# Altium project LP_LED_CUBE_8x8x8.PrjPcb
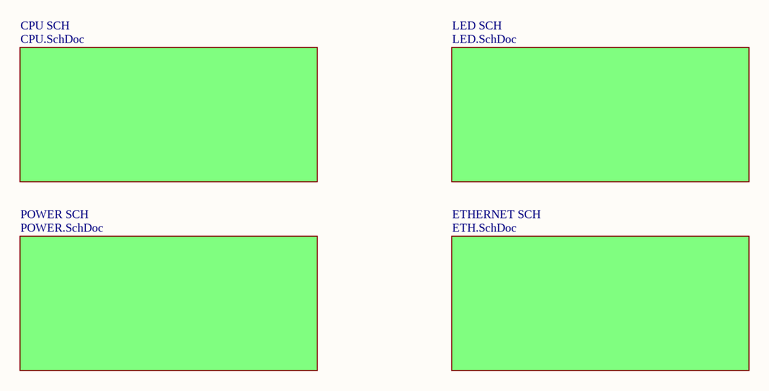
[diagram p0: LP_LED_CUBE_8x8x8.SchDoc]
Title: LED Cube 8x8x8
5 sheets, 91 parts. Net scope: global (net labels, ports and power ports of the same name join across sheets).
Board file: LP_LED_CUBE_8x8x8.PcbDoc
Sheets:
  LP_LED_CUBE_8x8x8.SchDoc
    CPU SCH = CPU.SchDoc
    LED SCH = LED.SchDoc
    POWER SCH = POWER.SchDoc
    ETHERNET SCH = ETH.SchDoc

## Sheet LP_LED_CUBE_8x8x8.SchDoc: LED Cube 8x8x8
size A4

### Sub-sheets
CPU SCH = CPU.SchDoc: no entries
ETHERNET SCH = ETH.SchDoc: no entries
LED SCH = LED.SchDoc: no entries
POWER SCH = POWER.SchDoc: no entries

## Sheet CPU.SchDoc: LED CUBE 8x8x8 - CPU
size A4; Author: Luka Penger; CompanyName: L. Penger; DrawnBy: Luka Penger; Organization: L. Penger; Address1: Luka Penger; Address2: http://lukapenger.eu; Address3: Software & Hardware; Address4: Development; DocumentNumber: 1; Revision: 4.0.0; SheetNumber: 1; SheetTotal: 5; DocumentName: CPU; ImagePath: I:\lp-led-cube-8x8x8\LP_LED_CUBE_8x8x8_PCB\ver_1.0.0; ProjectName: LED CUBE 8x8x8
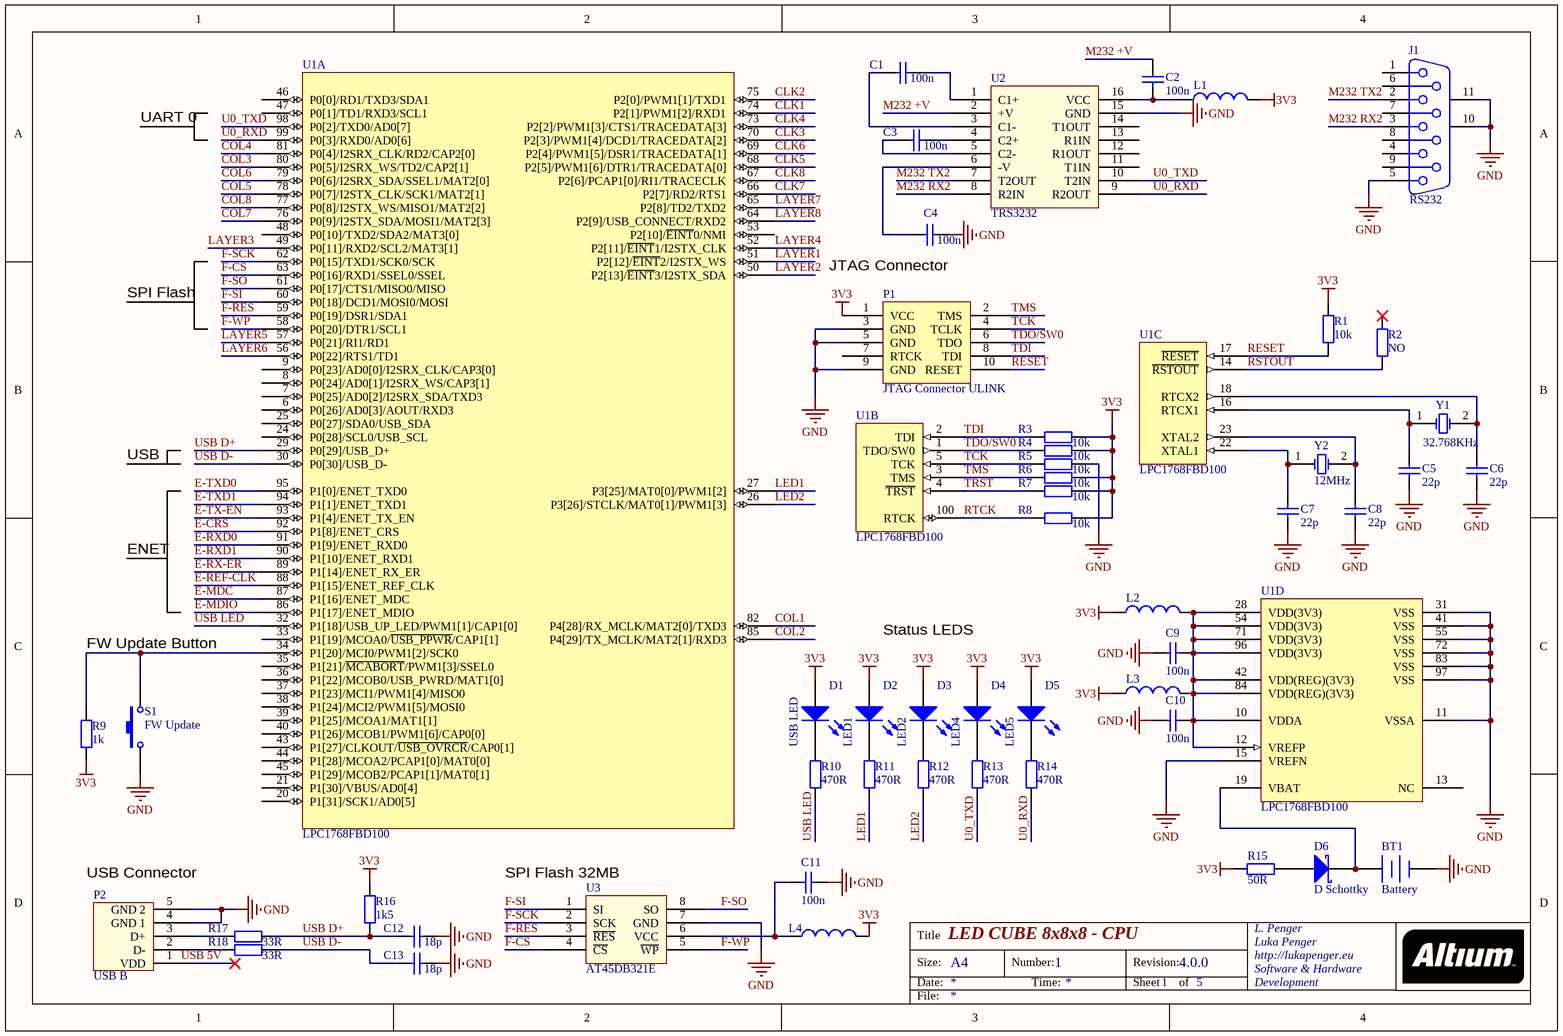
[diagram p1: CPU.SchDoc]

### Parts
BT1  Battery  [Battery capacitor]
C1  100n  [1608[0603]]
C2  100n  [1608[0603]]
C3  100n  [1608[0603]]
C4  100n  [1608[0603]]
C5  22p  [1608[0603]]
C6  22p  [1608[0603]]
C7  22p  [1608[0603]]
C8  22p  [1608[0603]]
C9  100n  [1608[0603]]
C10  100n  [1608[0603]]
C11  100n  [1608[0603]]
C12  18p  [1608[0603]]
C13  18p  [1608[0603]]
D1  USB LED  [LED-1]
D2  LED1  [LED-1]
D3  LED2  [LED-1]
D4  LED4  [LED-1]
D5  LED5  [LED-1]
D6  D Schottky  [SMB]
J1  RS232  [DSUB1.385-2H9]
L1  Inductor  [1608[0603]]  (value not drawn)
L2  Inductor  [1608[0603]]  (value not drawn)
L3  Inductor  [1608[0603]]  (value not drawn)
L4  Inductor  [1608[0603]]  (value not drawn)
P1  JTAG Connector ULINK  [JTAG Connector ULINK]
P2  USB B  [USB B]
R1  10k  [1608[0603]]
R2  NO  [1608[0603]]
R3  10k  [1608[0603]]
R4  10k  [1608[0603]]
R5  10k  [1608[0603]]
R6  10k  [1608[0603]]
R7  10k  [1608[0603]]
R8  10k  [1608[0603]]
R9  1k  [1608[0603]]
R10  470R  [1608[0603]]
R11  470R  [1608[0603]]
R12  470R  [1608[0603]]
R13  470R  [1608[0603]]
R14  470R  [1608[0603]]
R15  50R  [6-0805_N]
R16  1k5  [1608[0603]]
R17  33R  [1608[0603]]
R18  33R  [1608[0603]]
S1  FW Update  [SWITCH-TACTILE-90]
U1  LPC1768FBD100  [SOT407-1_N]  (parts A,B,C,D of 4)
U2  TRS3232  [SOIC16_N]
U3  AT45DB321E  [AT45DB321D]
Y1  32.768KHz  [Crystal 4.1x1.5]
Y2  12MHz  [5x3.2 Crystal]

### Nets
3V3: D1.1(A) D2.1(A) D3.1(A) D4.1(A) D5.1(A) L1.2 L2.1 L3.1 L4.2 P1.1(VCC) R1.2 R3.2 R4.2 R6.2 R7.2 R8.2 R9.1 R15.2 R16.1
GND: BT1.2(-) C4.1 C5.1 C6.1 C7.1 C8.1 C9.2 C10.1 C11.1 C12.2 C13.2 J1.5 J1.10(MH1) J1.11(MH2) P1.3(GND) P1.5(GND) P1.9(GND) P2.4(GND_1) P2.5(GND_2) R5.2 S1.1 U1.11(VSSA) U1.15(VREFN) U1.31(VSS) U1.41(VSS) U1.55(VSS) U1.72(VSS) U1.83(VSS) U1.97(VSS) U2.15(GND) U3.7(GND)
CLK1: U1.74(P2[1]/PWM1[2]/RXD1)
CLK2: U1.75(P2[0]/PWM1[1]/TXD1)
CLK3: U1.70(P2[3]/PWM1[4]/DCD1/TRACEDATA[2])
CLK4: U1.73(P2[2]/PWM1[3]/CTS1/TRACEDATA[3])
CLK5: U1.68(P2[5]/PWM1[6]/DTR1/TRACEDATA[0])
CLK6: U1.69(P2[4]/PWM1[5]/DSR1/TRACEDATA[1])
CLK7: U1.66(P2[7]/RD2/RTS1)
CLK8: U1.67(P2[6]/PCAP1[0]/RI1/TRACECLK)
COL1: U1.82(P4[28]/RX_MCLK/MAT2[0]/TXD3)
COL2: U1.85(P4[29]/TX_MCLK/MAT2[1]/RXD3)
COL3: U1.80(P0[5]/I2SRX_WS/TD2/CAP2[1])
COL4: U1.81(P0[4]/I2SRX_CLK/RD2/CAP2[0])
COL5: U1.78(P0[7]/I2STX_CLK/SCK1/MAT2[1])
COL6: U1.79(P0[6]/I2SRX_SDA/SSEL1/MAT2[0])
COL7: U1.76(P0[9]/I2STX_SDA/MOSI1/MAT2[3])
COL8: U1.77(P0[8]/I2STX_WS/MISO1/MAT2[2])
E-CRS: U1.92(P1[8]/ENET_CRS)
E-MDC: U1.87(P1[16]/ENET_MDC)
E-MDIO: U1.86(P1[17]/ENET_MDIO)
E-REF-CLK: U1.88(P1[15]/ENET_REF_CLK)
E-RX-ER: U1.89(P1[14]/ENET_RX_ER)
E-RXD0: U1.91(P1[9]/ENET_RXD0)
E-RXD1: U1.90(P1[10]/ENET_RXD1)
E-TX-EN: U1.93(P1[4]/ENET_TX_EN)
E-TXD0: U1.95(P1[0]/ENET_TXD0)
E-TXD1: U1.94(P1[1]/ENET_TXD1)
F-CS: U1.63(P0[16]/RXD1/SSEL0/SSEL) U3.4(~{CS})
F-RES: U1.59(P0[19]/DSR1/SDA1) U3.3(~{RES})
F-SCK: U1.62(P0[15]/TXD1/SCK0/SCK) U3.2(SCK)
F-SI: U1.60(P0[18]/DCD1/MOSI0/MOSI) U3.1(SI)
F-SO: U1.61(P0[17]/CTS1/MISO0/MISO) U3.8(SO)
F-WP: U1.58(P0[20]/DTR1/SCL1) U3.5(~{WP})
LAYER1: U1.51(P2[12]/~{EINT}2/I2STX_WS)
LAYER2: U1.50(P2[13]/~{EINT}3/I2STX_SDA)
LAYER3: U1.49(P0[11]/RXD2/SCL2/MAT3[1])
LAYER4: U1.52(P2[11]/~{EINT}1/I2STX_CLK)
LAYER5: U1.57(P0[21]/RI1/RD1)
LAYER6: U1.56(P0[22]/RTS1/TD1)
LAYER7: U1.65(P2[8]/TD2/TXD2)
LAYER8: U1.64(P2[9]/USB_CONNECT/RXD2)
LED1: R11.1 U1.27(P3[25]/MAT0[0]/PWM1[2])
LED2: R12.1 U1.26(P3[26]/STCLK/MAT0[1]/PWM1[3])
M232 +V: C2.1 U2.2(+V)
M232 RX2: J1.3 U2.8(R2IN)
M232 TX2: J1.2 U2.7(T2OUT)
RESET: P1.10(RESET) R1.1 U1.17(~{RESET})
RSTOUT: R2.1 U1.14(~{RSTOUT})
RTCK: R8.1 U1.100(RTCK)
TCK: P1.4(TCLK) R5.1 U1.5(TCK)
TDI: P1.8(TDI) R3.1 U1.2(TDI)
TDO/SW0: P1.6(TDO) R4.1 U1.1(TDO/SW0)
TMS: P1.2(TMS) R6.1 U1.3(TMS)
TRST: R7.1 U1.4(~{TRST})
U0_RXD: R14.1 U1.99(P0[3]/RXD0/AD0[6]) U2.9(R2OUT)
U0_TXD: R13.1 U1.98(P0[2]/TXD0/AD0[7]) U2.10(T2IN)
USB D+: C12.1 R16.2 R17.1 U1.29(P0[29]/USB_D+)
USB D-: C13.1 R18.1 U1.30(P0[30]/USB_D-)
USB LED: R10.1 U1.32(P1[18]/USB_UP_LED/PWM1[1]/CAP1[0])
NetBT1_1: BT1.1(+) D6.2(K) U1.19(VBAT)
NetC1_1: C1.1 U2.3(C1-)
NetC1_2: C1.2 U2.1(C1+)
NetC2_2: C2.2 L1.1 U2.16(VCC)
NetC3_1: C3.1 U2.5(C2-)
NetC3_2: C3.2 U2.4(C2+)
NetC4_2: C4.2 U2.6(-V)
NetC5_2: C5.2 U1.16(RTCX1) Y1.1(OSC1)
NetC6_2: C6.2 U1.18(RTCX2) Y1.2(OSC2)
NetC7_2: C7.2 U1.22(XTAL1) Y2.1(OSC1)
NetC8_2: C8.2 U1.23(XTAL2) Y2.2(OSC2)
NetC9_1: C9.1 C10.2 L2.2 L3.2 U1.10(VDDA) U1.12(VREFP) U1.28(VDD(3V3)) U1.42(VDD(REG)(3V3)) U1.54(VDD(3V3)) U1.71(VDD(3V3)) U1.84(VDD(REG)(3V3)) U1.96(VDD(3V3))
NetC11_2: C11.2 L4.1 U3.6(VCC)
NetD1_2: D1.2(K) R10.2
NetD2_2: D2.2(K) R11.2
NetD3_2: D3.2(K) R12.2
NetD4_2: D4.2(K) R13.2
NetD5_2: D5.2(K) R14.2
NetD6_1: D6.1(A) R15.1
NetP2_2: P2.2(D-) R18.2
NetP2_3: P2.3(D+) R17.2
NetR9_2: R9.2 S1.2 U1.34(P1[20]/MCI0/PWM1[2]/SCK0)

Not connected (* = marked no-connect by the designer): J1 1 4 6 7 8 9; P1 7(RTCK); P2 1(VDD)*; R2 2*; U1 6(P0[26]/AD0[3]/AOUT/RXD3) 7(P0[25]/AD0[2]/I2SRX_SDA/TXD3) 8(P0[24]/AD0[1]/I2SRX_WS/CAP3[1]) 9(P0[23]/AD0[0]/I2SRX_CLK/CAP3[0]) 13(NC) 20(P1[31]/SCK1/AD0[5]) 21(P1[30]/VBUS/AD0[4]) 24(P0[28]/SCL0/USB_SCL) 25(P0[27]/SDA0/USB_SDA) 33(P1[19]/MCOA0/~{USB_PPWR}/CAP1[1]) 35(P1[21]/~{MCABORT}/PWM1[3]/SSEL0) 36(P1[22]/MCOB0/USB_PWRD/MAT1[0]) 37(P1[23]/MCI1/PWM1[4]/MISO0) 38(P1[24]/MCI2/PWM1[5]/MOSI0) 39(P1[25]/MCOA1/MAT1[1]) 40(P1[26]/MCOB1/PWM1[6]/CAP0[0]) 43(P1[27]/CLKOUT/~{USB_OVRCR}/CAP0[1]) 44(P1[28]/MCOA2/PCAP1[0]/MAT0[0]) 45(P1[29]/MCOB2/PCAP1[1]/MAT0[1]) 46(P0[0]/RD1/TXD3/SDA1) 47(P0[1]/TD1/RXD3/SCL1) 48(P0[10]/TXD2/SDA2/MAT3[0]) 53(P2[10]/~{EINT}0/NMI); U2 11(T1IN) 12(R1OUT) 13(R1IN) 14(T1OUT)

### Notes on the sheet
- UART 0
- SPI Flash
- JTAG Connector
- USB
- ENET
- FW Update Button
- Status LEDS
- (near P2) USB Connector
- (near U3) SPI Flash 32MB
- Labels drawn without touching a wire or pin: USB 5V
- Title
- Size:
- Date:
- A4
- Number:
- Time:
- Revision:
- Sheet
- of
- File:

### Library data of the parts
BT1 = Battery: Multicell Battery; Published: 24-Mar-1999; LatestRevisionDate: 17-Jul-2002; LatestRevisionNote: Re-released for DXP Platform.; PackageReference: BAT-2; Publisher: Altium Limited; PackageDescription: Battery; 2 Leads
C1-C13 = Cap: Capacitor; Value: 100pF; Published: 8-Jun-2000; LatestRevisionDate: 17-Jul-2002; LatestRevisionNote: Re-released for DXP Platform.; PackageReference: RAD-0.3; Publisher: Altium Limited; PackageDescription: Radial Cap, Thru-Hole; 2 Leads; 0.3 in Pin Spacing
D1-D5 = LED0: Typical INFRARED GaAs LED; Published: 8-Jun-2000; LatestRevisionDate: 08-Jul-2005; LatestRevisionNote: Mech Layer 1 removed.; PackageReference: LED-0; Publisher: Altium Limited; PackageDescription: LED; 2 Leads
D6 = D Schottky: Schottky Diode; Published: 8-Jun-2000; LatestRevisionDate: 17-Jul-2002; LatestRevisionNote: Re-released for DXP Platform.; PackageReference: SMB; Publisher: Altium Limited; PackageDescription: DO-214-AA/SMB; 2 C-Bend Leads; Body 5.3 x 3.6 mm, inc. leads (LxW); Code_JEDEC: DO-214-AA
J1 = D Connector 9: Receptacle Assembly, 9 Position, Right Angle; PackageDocument: O; Positions: 9; Published: 15-Jun-2001; LatestRevisionDate: 17-Jul-2002; LatestRevisionNote: Re-released for DXP Platform.; DatasheetDocument: 1-Sep-1999; PackageReference: 788750; Publisher: Altium Limited; Orientation: Right Angle; Gender: Receptacle
L1-L4 = Inductor: Code_IEC: 1005; Value: 10mH; Published: 8-Jun-2000; LatestRevisionDate: 29-May-2009; LatestRevisionNote: IPC-7351 Footprint Added.; PackageReference: 0402-A; Publisher: Altium Limited; PackageDescription: Chip Inductor; Code_JEITA: 0402
P1 = JTAG Connector ULINK: JTAG Connector
P2 = USB B: USB Connector
R1-R8 R10-R18 = Res2: Resistor; Value: 1K; Published: 8-Jun-2000; LatestRevisionDate: 17-Jul-2002; LatestRevisionNote: Re-released for DXP Platform.; PackageReference: AXIAL-0.4; Publisher: Altium Limited; PackageDescription: Axial Device, Thru-Hole; 2 Leads; 0.4 in Pin Spacing
R9 = Res2: Resistor; Published: 8-Jun-2000; LatestRevisionDate: 17-Jul-2002; LatestRevisionNote: Re-released for DXP Platform.; PackageReference: AXIAL-0.4; Publisher: Altium Limited; PackageDescription: Axial Device, Thru-Hole; 2 Leads; 0.4 in Pin Spacing; Value: 1K
S1 = SW-PB: Switch; Published: 24-Mar-1999; LatestRevisionDate: 17-Jul-2002; LatestRevisionNote: Re-released for DXP Platform.; PackageReference: SPST-2; Publisher: Altium Limited; PackageDescription: Switch; 2 Leads
U1 = LPC1768FBD100: 32-bit ARM Cortex-M3 microcontroller; up to 512 kB flash and 64 kB SRAM with Ethernet, USB 2.0 Host/Device/OTG, CAN; Code_IEC: 136E20; Published: 17-Aug-2007; DatasheetVersion: rev.01, Jan-2007; PackageVersion: Feb-2003; PackageReference: SOT407-1; Publisher: Altium Limited; PackageDescription: 100-Pin Plastic Low Profile Quad Flat Pack, LQFP100; Code_JEDEC: MS-026; ComponentLink1Description: Manufacturer Link; ComponentLink1URL: http://www.nxp.com/; ComponentLink2Description: Datasheet; ComponentLink2URL: http://www.standardics.nxp.com/products/lpc2000/datasheet/lpc2364.lpc2366.lpc2368.pdf
U2 = MAX2232: Dual 232 +3V3
U3 = AT45DB321D: SPI Flash 32MB
Y1 Y2 = XTAL: Crystal Oscillator; Published: 8-Jun-2000; LatestRevisionDate: 17-Jul-2002; LatestRevisionNote: Re-released for DXP Platform.; PackageReference: R38; Publisher: Altium Limited; PackageDescription: Crystal, Thru-Hole; 2 Leads; Body 3.1 x 8.2 mm (Dia.xH)

## Sheet LED.SchDoc: LED Cube 8x8x8 - LED
size A4; Author: Luka Penger; CompanyName: L. Penger; DrawnBy: Luka Penger; Organization: L. Penger; Address1: Luka Penger; Address2: http://lukapenger.eu; Address3: Software & Hardware; Address4: Development; DocumentNumber: 3; Revision: 4.0.0; SheetNumber: 3; SheetTotal: 5; DocumentName: LED; ProjectName: LED Cube 8x8x8
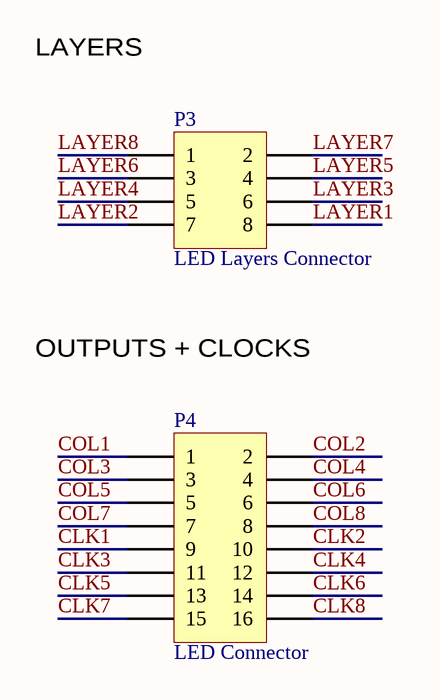
[diagram p2: LED.SchDoc]

### Parts
P3  LED Layers Connector  [IDC-2x4]
P4  LED Connector  [IDC-2x8]

### Nets
CLK1: P4.9
CLK2: P4.10
CLK3: P4.11
CLK4: P4.12
CLK5: P4.13
CLK6: P4.14
CLK7: P4.15
CLK8: P4.16
COL1: P4.1
COL2: P4.2
COL3: P4.3
COL4: P4.4
COL5: P4.5
COL6: P4.6
COL7: P4.7
COL8: P4.8
LAYER1: P3.8
LAYER2: P3.7
LAYER3: P3.6
LAYER4: P3.5
LAYER5: P3.4
LAYER6: P3.3
LAYER7: P3.2
LAYER8: P3.1

### Notes on the sheet
- LAYERS
- OUTPUTS + CLOCKS
- Title
- Size:
- Date:
- A4
- Number:
- Time:
- Revision:
- Sheet
- of
- File:

### Library data of the parts
P3 = Header 4X2: Header, 4-Pin, Dual row; LatestRevisionDate: 17-Jul-2002; LatestRevisionNote: Re-released for DXP Platform.; Publisher: Altium Limited
P4 = Header 8X2: Header, 8-Pin, Dual row; LatestRevisionDate: 17-Jul-2002; LatestRevisionNote: Re-released for DXP Platform.; Publisher: Altium Limited

## Sheet POWER.SchDoc: LED Cube 8x8x8 - POWER
size A4; Author: Luka Penger; CompanyName: L. Penger; DrawnBy: Luka Penger; Organization: L. Penger; Address1: Luka Penger; Address2: http://lukapenger.eu; Address3: Software & Hardware; Address4: Development; DocumentNumber: 2; Revision: 4.0.0; SheetNumber: 2; SheetTotal: 5; DocumentName: POWER; ProjectName: LED Cube 8x8x8
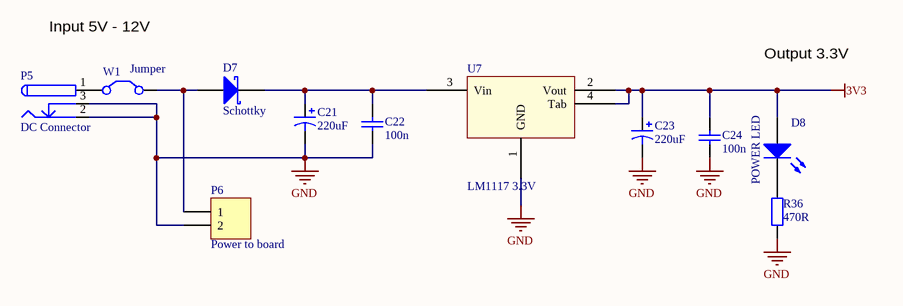
[diagram p3: POWER.SchDoc]

### Parts
C21  220uF  [SMD CAPACITOR 220uF]
C22  100n  [1608[0603]]
C23  220uF  [SMD CAPACITOR 220uF]
C24  100n  [1608[0603]]
D7  Schottky  [SMB]
D8  POWER LED  [LED-1]
P5  DC Connector  [DC Connector]
P6  Power to board  [Block2 - 3.81]
R36  470R  [1608[0603]]
U7  LM1117 3.3V  [TO220]
W1  Jumper  [HDR1X2]

### Nets
3V3: C23.1 C24.1 D8.1(A) U7.2(Vout) U7.4(Tab)
GND: C21.2 C22.2 C23.2 C24.2 P5.2 P5.3 P6.2 R36.1 U7.1(GND)
NetC21_1: C21.1 C22.1 D7.2(K) U7.3(Vin)
NetD7_1: D7.1(A) P6.1 W1.2(C2)
NetD8_2: D8.2(K) R36.2
NetP5_1: P5.1 W1.1(C1)

### Notes on the sheet
- Input 5V - 12V
- Output 3.3V
- Title
- Size:
- Date:
- A4
- Number:
- Time:
- Revision:
- Sheet
- of
- File:

### Library data of the parts
C21 C23 = Cap Pol1: Capacitor; Value: 100pF; Published: 8-Jun-2000; LatestRevisionDate: 17-Jul-2002; LatestRevisionNote: Re-released for DXP Platform.; PackageReference: RB7.6-15; Publisher: Altium Limited; PackageDescription: Polarized Capacitor (Radial); 2 Leads
C22 C24 = Cap: Capacitor; Value: 100pF; Published: 8-Jun-2000; LatestRevisionDate: 17-Jul-2002; LatestRevisionNote: Re-released for DXP Platform.; PackageReference: RAD-0.3; Publisher: Altium Limited; PackageDescription: Radial Cap, Thru-Hole; 2 Leads; 0.3 in Pin Spacing
D7 = D Schottky: Schottky Diode; Published: 8-Jun-2000; LatestRevisionDate: 17-Jul-2002; LatestRevisionNote: Re-released for DXP Platform.; PackageReference: SMB; Publisher: Altium Limited; PackageDescription: DO-214-AA/SMB; 2 C-Bend Leads; Body 5.3 x 3.6 mm, inc. leads (LxW); Code_JEDEC: DO-214-AA
D8 = LED0: Typical INFRARED GaAs LED; Published: 8-Jun-2000; LatestRevisionDate: 08-Jul-2005; LatestRevisionNote: Mech Layer 1 removed.; PackageReference: LED-0; Publisher: Altium Limited; PackageDescription: LED; 2 Leads
P5 = DC Connector: DC Power Connector
P6 = Header 2: Header, 2-Pin; LatestRevisionDate: 17-Jul-2002; LatestRevisionNote: Re-released for DXP Platform.; Publisher: Altium Limited
R36 = Res2: Resistor; Value: 1K; Published: 8-Jun-2000; LatestRevisionDate: 17-Jul-2002; LatestRevisionNote: Re-released for DXP Platform.; PackageReference: AXIAL-0.4; Publisher: Altium Limited; PackageDescription: Axial Device, Thru-Hole; 2 Leads; 0.4 in Pin Spacing
U7 = LM1117: Voltage Regulator
W1 = Jumper: Jumper Wire; Published: 24-Mar-1999; LatestRevisionDate: 17-Jul-2002; LatestRevisionNote: Re-released for DXP Platform.; PackageReference: RAD-0.2; Publisher: Altium Limited; PackageDescription: Radial Cap, Thru-Hole; 2 Leads; 0.2 in Pin Spacing

## Sheet ETH.SchDoc: LED Cube 8x8x8 - Ethernet
size A4; Author: Luka Penger; CompanyName: L. Penger; DrawnBy: Luka Penger; Organization: L. Penger; Address1: Luka Penger; Address2: http://lukapenger.eu; Address3: Software & Hardware; Address4: Development; DocumentNumber: 5; Revision: 4.0.0; SheetNumber: 5; SheetTotal: 5; DocumentName: ETH; ProjectName: LED Cube 8x8x8
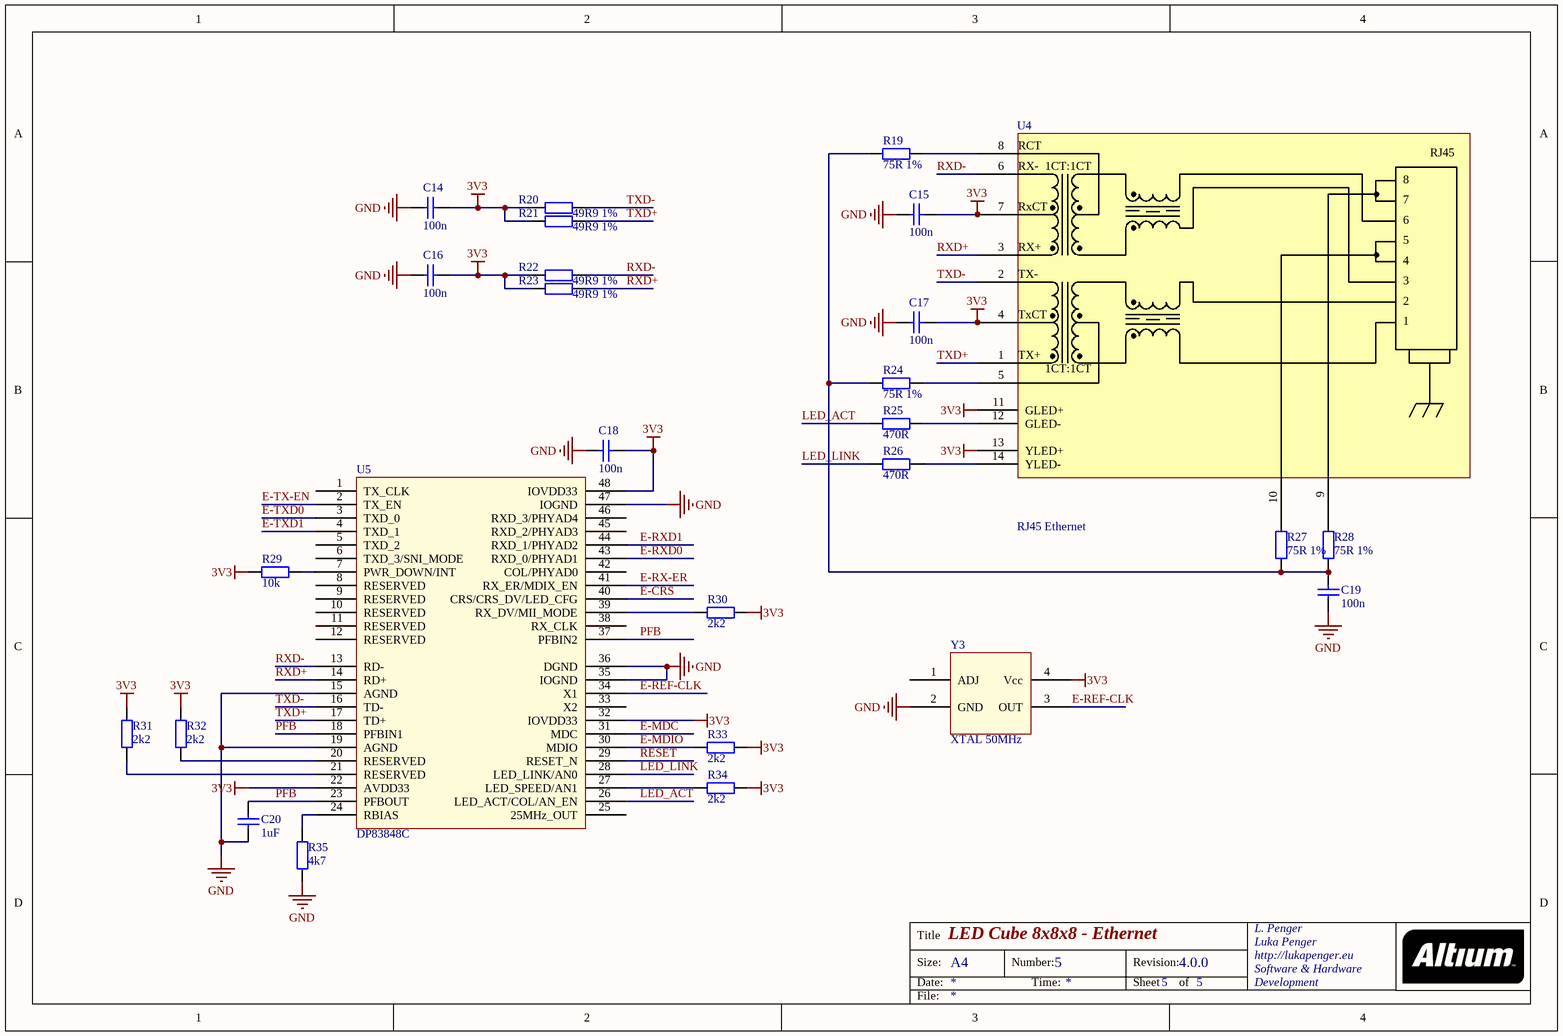
[diagram p4: ETH.SchDoc]

### Parts
C14  100n  [1608[0603]]
C15  100n  [1608[0603]]
C16  100n  [1608[0603]]
C17  100n  [1608[0603]]
C18  100n  [1608[0603]]
C19  100n  [1608[0603]]
C20  1uF  [6-0805_L]
R19  75R 1%  [1608[0603]]
R20  49R9 1%  [1608[0603]]
R21  49R9 1%  [1608[0603]]
R22  49R9 1%  [1608[0603]]
R23  49R9 1%  [1608[0603]]
R24  75R 1%  [1608[0603]]
R25  470R  [1608[0603]]
R26  470R  [1608[0603]]
R27  75R 1%  [1608[0603]]
R28  75R 1%  [1608[0603]]
R29  10k  [1608[0603]]
R30  2k2  [1608[0603]]
R31  2k2  [1608[0603]]
R32  2k2  [1608[0603]]
R33  2k2  [1608[0603]]
R34  2k2  [1608[0603]]
R35  4k7  [1608[0603]]
U4  RJ45 Ethernet  [RJ45 Ethernet connector]
U5  DP83848C  [DP83848C]
Y3  XTAL 50MHz  [XTAL ACT9200]

### Nets
3V3: C14.2 C15.2 C16.2 C17.2 C18.2 R20.2 R21.2 R22.2 R23.2 R29.2 R30.1 R31.1 R32.2 R33.1 R34.1 U4.4 U4.7 U4.11(GLED+) U4.13(YLED+) U5.22(AVDD33) U5.32(IOVDD33) U5.48(IOVDD33) Y3.4(Vcc)
GND: C14.1 C15.1 C16.1 C17.1 C18.1 C19.2 C20.2 R35.2 U5.15(AGND) U5.19(AGND) U5.35(IOGND) U5.36(DGND) U5.47(IOGND) Y3.2(GND)
E-CRS: U5.40(CRS/CRS_DV/LED_CFG)
E-MDC: U5.31(MDC)
E-MDIO: R33.2 U5.30(MDIO)
E-REF-CLK: U5.34(X1) Y3.3(OUT)
E-RX-ER: U5.41(RX_ER/MDIX_EN)
E-RXD0: U5.43(RXD_0/PHYAD1)
E-RXD1: U5.44(RXD_1/PHYAD2)
E-TX-EN: U5.2(TX_EN)
E-TXD0: U5.3(TXD_0)
E-TXD1: U5.4(TXD_1)
LED_ACT: R25.2 U5.26(LED_ACT/COL/AN_EN)
LED_LINK: R26.2 U5.28(LED_LINK/AN0)
PFB: C20.1 U5.18(PFBIN1) U5.23(PFBOUT) U5.37(PFBIN2)
RESET: U5.29(RESET_N)
RXD+: R23.1 U4.3 U5.14(RD+)
RXD-: R22.1 U4.6 U5.13(RD-)
TXD+: R21.1 U4.1 U5.17(TD+)
TXD-: R20.1 U4.2 U5.16(TD-)
NetC19_1: C19.1 R19.2 R24.2 R27.1 R28.1
NetR19_1: R19.1 U4.8
NetR24_1: R24.1 U4.5
NetR25_1: R25.1 U4.12(GLED-)
NetR26_1: R26.1 U4.14(YLED-)
NetR27_2: R27.2 U4.10
NetR28_2: R28.2 U4.9
NetR29_1: R29.1 U5.7(PWR_DOWN/INT)
NetR30_2: R30.2 U5.39(RX_DV/MII_MODE)
NetR31_2: R31.2 U5.21(RESERVED)
NetR32_1: R32.1 U5.20(RESERVED)
NetR34_2: R34.2 U5.27(LED_SPEED/AN1)
NetR35_1: R35.1 U5.24(RBIAS)

Not connected (* = marked no-connect by the designer): U5 1(TX_CLK) 5(TXD_2) 6(TXD_3/SNI_MODE) 8(RESERVED) 9(RESERVED) 10(RESERVED) 11(RESERVED) 12(RESERVED) 25(25MHz_OUT) 33(X2) 38(RX_CLK) 42(COL/PHYAD0) 45(RXD_2/PHYAD3) 46(RXD_3/PHYAD4); Y3 1(ADJ)

### Notes on the sheet
- Title
- Size:
- Date:
- A4
- Number:
- Time:
- Revision:
- Sheet
- of
- File:
- (in symbol RJ45 Ethernet) RCT; RJ45; RX-; 1CT:1CT; RxCT; RX+; TX-; TxCT; TX+

### Library data of the parts
C14-C20 = Cap: Capacitor; Value: 100pF; Published: 8-Jun-2000; LatestRevisionDate: 17-Jul-2002; LatestRevisionNote: Re-released for DXP Platform.; PackageReference: RAD-0.3; Publisher: Altium Limited; PackageDescription: Radial Cap, Thru-Hole; 2 Leads; 0.3 in Pin Spacing
R19-R35 = Res2: Resistor; Value: 1K; Published: 8-Jun-2000; LatestRevisionDate: 17-Jul-2002; LatestRevisionNote: Re-released for DXP Platform.; PackageReference: AXIAL-0.4; Publisher: Altium Limited; PackageDescription: Axial Device, Thru-Hole; 2 Leads; 0.4 in Pin Spacing
U4 = RJ45 Ethernet: Ethernet Connector
U5 = DP83848C: Ethernet PHY
Y3 = XTAL ACT9200

## Nets that join several sheets
3V3: CPU (19 pins), POWER (5 pins), ETH (23 pins)
GND: CPU (31 pins), POWER (9 pins), ETH (14 pins)
CLK1: CPU (U1.74), LED (P4.9)
CLK2: CPU (U1.75), LED (P4.10)
CLK3: CPU (U1.70), LED (P4.11)
CLK4: CPU (U1.73), LED (P4.12)
CLK5: CPU (U1.68), LED (P4.13)
CLK6: CPU (U1.69), LED (P4.14)
CLK7: CPU (U1.66), LED (P4.15)
CLK8: CPU (U1.67), LED (P4.16)
COL1: CPU (U1.82), LED (P4.1)
COL2: CPU (U1.85), LED (P4.2)
COL3: CPU (U1.80), LED (P4.3)
COL4: CPU (U1.81), LED (P4.4)
COL5: CPU (U1.78), LED (P4.5)
COL6: CPU (U1.79), LED (P4.6)
COL7: CPU (U1.76), LED (P4.7)
COL8: CPU (U1.77), LED (P4.8)
E-CRS: CPU (U1.92), ETH (U5.40)
E-MDC: CPU (U1.87), ETH (U5.31)
E-MDIO: CPU (U1.86), ETH (R33.2 U5.30)
E-REF-CLK: CPU (U1.88), ETH (U5.34 Y3.3)
E-RX-ER: CPU (U1.89), ETH (U5.41)
E-RXD0: CPU (U1.91), ETH (U5.43)
E-RXD1: CPU (U1.90), ETH (U5.44)
E-TX-EN: CPU (U1.93), ETH (U5.2)
E-TXD0: CPU (U1.95), ETH (U5.3)
E-TXD1: CPU (U1.94), ETH (U5.4)
LAYER1: CPU (U1.51), LED (P3.8)
LAYER2: CPU (U1.50), LED (P3.7)
LAYER3: CPU (U1.49), LED (P3.6)
LAYER4: CPU (U1.52), LED (P3.5)
LAYER5: CPU (U1.57), LED (P3.4)
LAYER6: CPU (U1.56), LED (P3.3)
LAYER7: CPU (U1.65), LED (P3.2)
LAYER8: CPU (U1.64), LED (P3.1)
RESET: CPU (P1.10 R1.1 U1.17), ETH (U5.29)